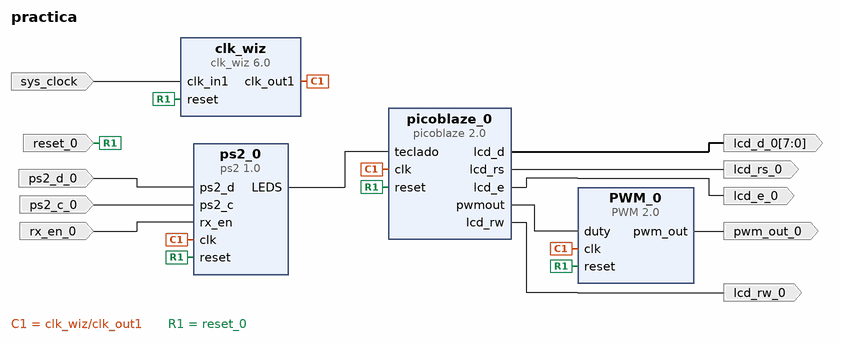
[diagram p0: block diagram of the top level]
# Vivado block design practica, xc7z020clg400-1, Vivado 2018.3
create_bd_design practica

create_bd_port -dir I -type clk sys_clock
set_property -dict {CONFIG.FREQ_HZ 125000000 CONFIG.PHASE 0.000} [get_bd_ports sys_clock]
create_bd_port -dir I -type rst reset_0
set_property -dict {CONFIG.POLARITY ACTIVE_HIGH} [get_bd_ports reset_0]
create_bd_port -dir I ps2_d_0
create_bd_port -dir I ps2_c_0
create_bd_port -dir I rx_en_0
create_bd_port -dir O pwm_out_0
create_bd_port -dir O lcd_rs_0
create_bd_port -dir O lcd_rw_0
create_bd_port -dir O lcd_e_0
create_bd_port -dir O -from 7 -to 0 lcd_d_0

create_bd_cell -type ip -vlnv user.org:user:ps2:1.0 ps2_0
create_bd_cell -type ip -vlnv user.org:user:PWM:2.0 PWM_0
create_bd_cell -type ip -vlnv xilinx.com:ip:clk_wiz:6.0 clk_wiz
set_property -dict {CONFIG.CLK_IN1_BOARD_INTERFACE sys_clock CONFIG.USE_BOARD_FLOW true} [get_bd_cells clk_wiz]
create_bd_cell -type ip -vlnv user.org:user:picoblaze:2.0 picoblaze_0

# ---- connections ----

connect_bd_net [get_bd_pins clk_wiz/clk_out1] [get_bd_pins PWM_0/clk] [get_bd_pins ps2_0/clk] [get_bd_pins picoblaze_0/clk]
connect_bd_net [get_bd_ports sys_clock] [get_bd_pins clk_wiz/clk_in1]
connect_bd_net -net reset_0_1 [get_bd_ports reset_0] \
  [get_bd_pins clk_wiz/reset] [get_bd_pins PWM_0/reset] [get_bd_pins ps2_0/reset] [get_bd_pins picoblaze_0/reset]
connect_bd_net -net ps2_d_0_1 [get_bd_ports ps2_d_0] [get_bd_pins ps2_0/ps2_d]
connect_bd_net -net ps2_c_0_1 [get_bd_ports ps2_c_0] [get_bd_pins ps2_0/ps2_c]
connect_bd_net -net rx_en_0_1 [get_bd_ports rx_en_0] [get_bd_pins ps2_0/rx_en]
connect_bd_net [get_bd_pins picoblaze_0/pwmout] [get_bd_pins PWM_0/duty]
connect_bd_net [get_bd_pins PWM_0/pwm_out] [get_bd_ports pwm_out_0]
connect_bd_net [get_bd_pins ps2_0/LEDS] [get_bd_pins picoblaze_0/teclado]
connect_bd_net [get_bd_pins picoblaze_0/lcd_rs] [get_bd_ports lcd_rs_0]
connect_bd_net [get_bd_pins picoblaze_0/lcd_rw] [get_bd_ports lcd_rw_0]
connect_bd_net [get_bd_pins picoblaze_0/lcd_e] [get_bd_ports lcd_e_0]
connect_bd_net [get_bd_pins picoblaze_0/lcd_d] [get_bd_ports lcd_d_0]

validate_bd_design
save_bd_design
